# EAGLE schematic floppyemu (EAGLE 6.3)
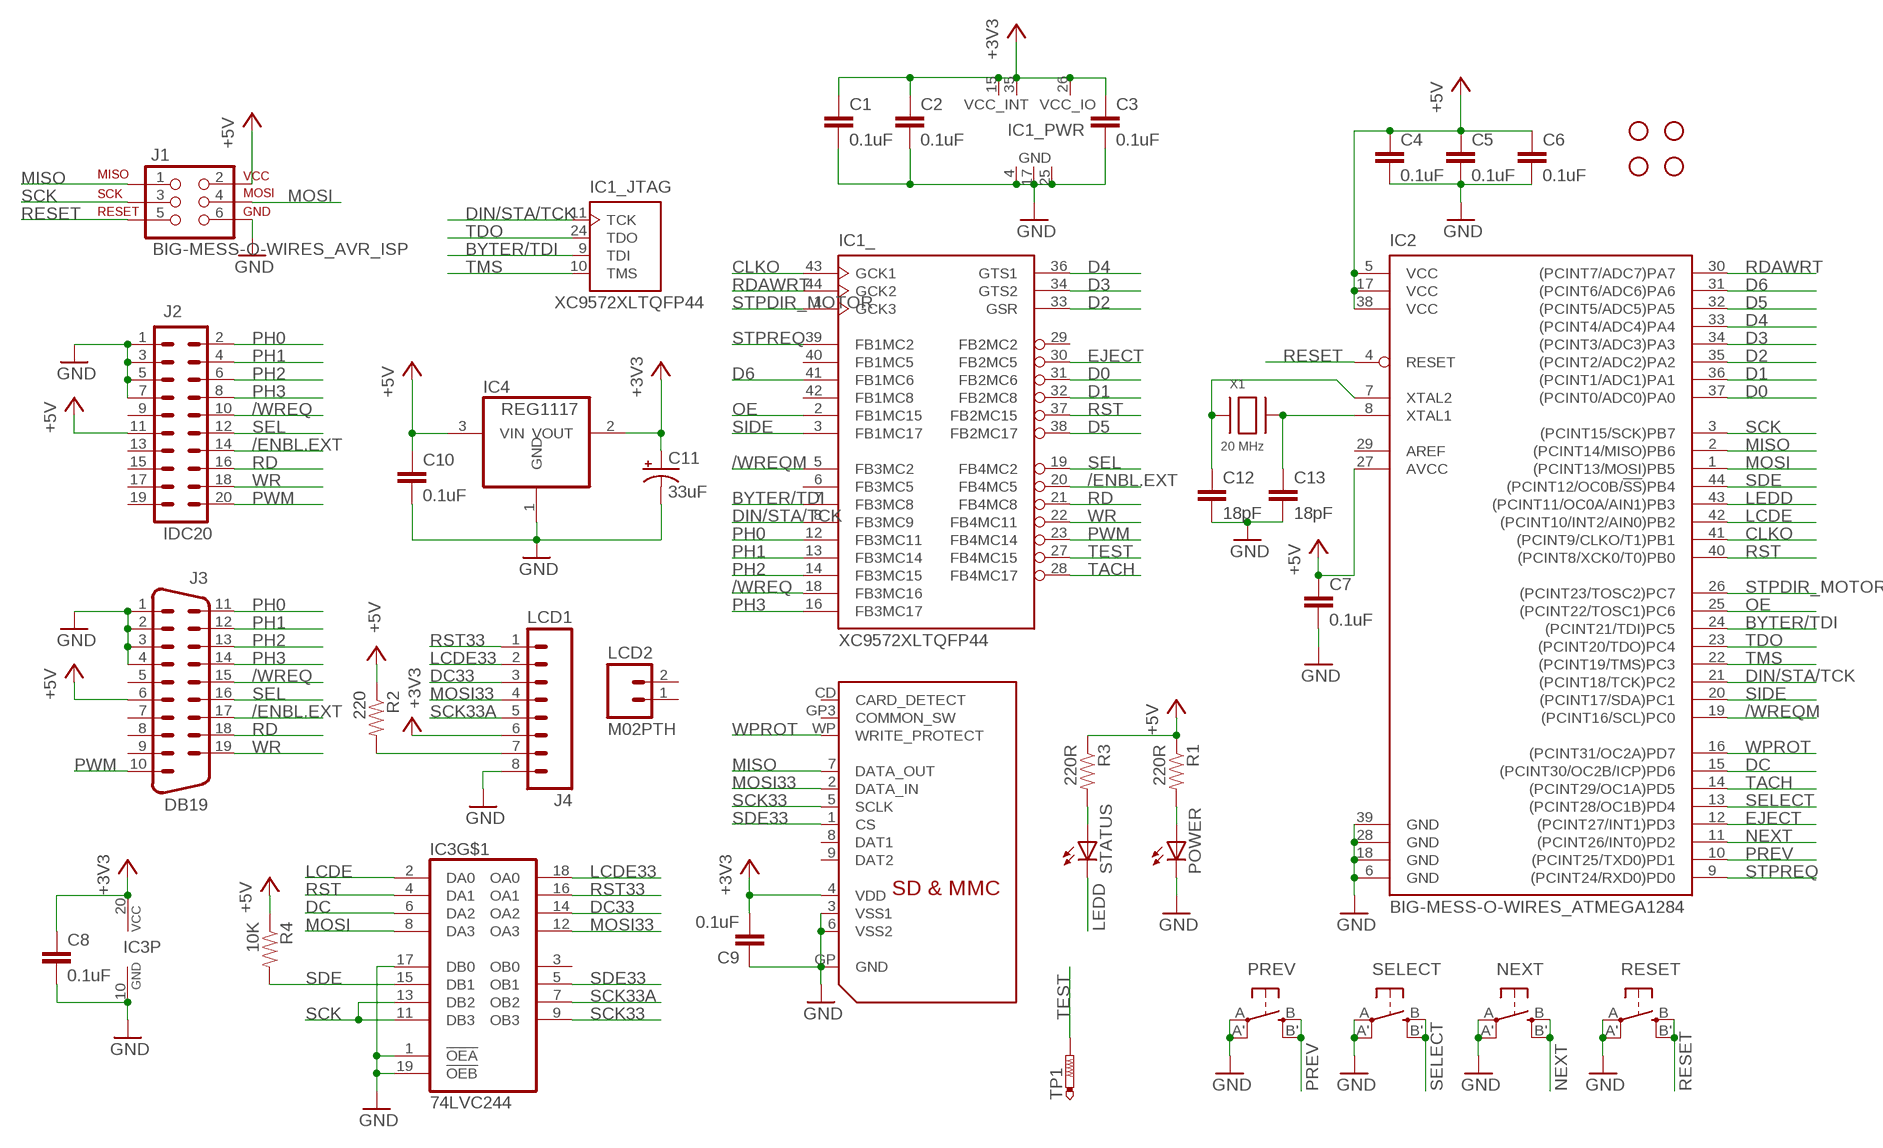
[diagram p0: schematic, sheet 1]

## Parts
C1  0.1uF  CAP0805  [0805]
C2  0.1uF  CAP0805  [0805]
C3  0.1uF  CAP0805  [0805]
C4  0.1uF  CAP0805  [0805]
C5  0.1uF  CAP0805  [0805]
C6  0.1uF  CAP0805  [0805]
C7  0.1uF  CAP0805  [0805]
C8  0.1uF  CAP0805  [0805]
C9  0.1uF  CAP0805  [0805]
C10  0.1uF  CAP0805  [0805]
C11  33uF  47UF-TANT  [EIA3528]
C12  18pF  CAP0805  [0805]
C13  18pF  CAP0805  [0805]
IC1  XC9572XLTQFP44  [TQFP44-LONGPADS]
IC2  BIG-MESS-O-WIRES_ATMEGA1284  [BIG-MESS-O-WIRES_TQFP44-LONGPADS]
IC3  74LVC244  74X244  [SSOP20]
IC4  REG1117  [SOT223]
J1  BIG-MESS-O-WIRES_AVR_ISP  [BIG-MESS-O-WIRES_2X3-SHROUDED]
J2  IDC20  [IDC20]
J3  DB19  DB19EDGE  [DB19EDGE]
J4  LCD1  M081X08  [1X08]
LCD2  M02PTH  [1X02]
NEXT  B3FS-10XX  [B3FS]
POWER  LEDCHIPLED_0805  [CHIPLED_0805]
PREV  B3FS-10XX  [B3FS]
R1  220R  RESISTOR0805-RES  [0805]
R2  220  RESISTORPTH-1/6W  [1/6W-RES]
R3  220R  RESISTOR0805-RES  [0805]
R4  10K  RESISTOR0805-RES  [0805]
RESET  B3FS-10XX  [B3FS]
SELECT  B3FS-10XX  [B3FS]
STANDOFF1  STAND-OFF  [STAND-OFF]
STANDOFF2  STAND-OFF  [STAND-OFF]
STANDOFF3  STAND-OFF  [STAND-OFF]
STANDOFF4  STAND-OFF  [STAND-OFF]
STATUS  LEDCHIPLED_0805  [CHIPLED_0805]
TP1  PTR1PAD1-13  [P1-13]
U1  ADAFRUIT_SDMMC06132  [ADAFRUIT_06132]
X1  20 MHz  XTALNX5032  [NX5032]

## Nets
+3V3: C1.1 C2.1 C3.1 C8.1 C9.2 C11.A(+) IC1.15(_PWR:VCC_INT) IC1.26(_PWR:VCC_IO) IC1.35(_PWR:VCC_INT) IC3.20(P:VCC) IC4.2(VOUT) J4.6 U1.4(VDD)
+5V: C4.1 C5.1 C6.1 C7.1 C10.1 IC2.5(VCC) IC2.17(VCC) IC2.27(AVCC) IC2.38(VCC) IC4.3(VIN) J1.2 J2.11 J3.6 R1.1 R2.1 R3.1 R4.1
/ENBL.EXT: IC1.20(_:FB4MC5) J2.14 J3.17
/WREQ: IC1.18(_:FB3MC16) J2.10 J3.15
/WREQM: IC1.5(_:FB3MC2) IC2.19((PCINT16/SCL)PC0)
BYTER/TDI: IC1.7(_:FB3MC8) IC1.9(_JTAG:TDI) IC2.24((PCINT21/TDI)PC5)
CLKO: IC1.43(_:GCK1) IC2.41((PCINT9/CLKO/T1)PB1)
D0: IC1.31(_:FB2MC6) IC2.37((PCINT0/ADC0)PA0)
D1: IC1.32(_:FB2MC8) IC2.36((PCINT1/ADC1)PA1)
D2: IC1.33(_:GSR) IC2.35((PCINT2/ADC2)PA2)
D3: IC1.34(_:GTS2) IC2.34((PCINT3/ADC3)PA3)
D4: IC1.36(_:GTS1) IC2.33((PCINT4/ADC4)PA4)
D5: IC1.38(_:FB2MC17) IC2.32((PCINT5/ADC5)PA5)
D6: IC1.41(_:FB1MC6) IC2.31((PCINT6/ADC6)PA6)
DC: IC2.15((PCINT30/OC2B/ICP)PD6) IC3.6(DA2)
DC33: IC3.14(OA2) J4.3
DIN/STA/TCK: IC1.8(_:FB3MC9) IC1.11(_JTAG:TCK) IC2.21((PCINT18/TCK)PC2)
EJECT: IC1.30(_:FB2MC5) IC2.12((PCINT27/INT1)PD3)
GND: C1.2 C2.2 C3.2 C4.2 C5.2 C6.2 C7.2 C8.2 C9.1 C10.2 C11.C(-) C12.2 C13.2 IC1.4(_PWR:GND) IC1.17(_PWR:GND) IC1.25(_PWR:GND) IC2.6(GND) IC2.18(GND) IC2.28(GND) IC2.39(GND) IC3.1(!OEA) IC3.10(P:GND) IC3.17(DB0) IC3.19(!OEB) IC4.1(GND) J1.6 J2.1 J2.3 J2.5 J2.7 J3.1 J3.2 J3.3 J3.4 J4.8 NEXT.A NEXT.A' POWER.C PREV.A PREV.A' RESET.A RESET.A' SELECT.A SELECT.A' U1.3(VSS1) U1.6(VSS2) U1.GP(GND)
LCDE: IC2.42((PCINT10/INT2/AIN0)PB2) IC3.2(DA0)
LCDE33: IC3.18(OA0) J4.2
LEDD: IC2.43((PCINT11/OC0A/AIN1)PB3) STATUS.C
MISO: IC2.2((PCINT14/MISO)PB6) J1.1 U1.7(DATA_OUT)
MOSI: IC2.1((PCINT13/MOSI)PB5) IC3.8(DA3) J1.4
MOSI33: IC3.12(OA3) J4.4 U1.2(DATA_IN)
N$1: C13.1 IC2.8(XTAL1) X1.P$2
N$2: POWER.A R1.2
N$3: C12.1 IC2.7(XTAL2) X1.P$1
N$5: R3.2 STATUS.A
N$10: J4.7 R2.2
NEXT: IC2.11((PCINT26/INT0)PD2) NEXT.B NEXT.B'
OE: IC1.2(_:FB1MC15) IC2.25((PCINT22/TOSC1)PC6)
PH0: IC1.12(_:FB3MC11) J2.2 J3.11
PH1: IC1.13(_:FB3MC14) J2.4 J3.12
PH2: IC1.14(_:FB3MC15) J2.6 J3.13
PH3: IC1.16(_:FB3MC17) J2.8 J3.14
PREV: IC2.10((PCINT25/TXD0)PD1) PREV.B PREV.B'
PWM: IC1.23(_:FB4MC14) J2.20 J3.10
RD: IC1.21(_:FB4MC8) J2.16 J3.18
RDAWRT: IC1.44(_:GCK2) IC2.30((PCINT7/ADC7)PA7)
RESET: IC2.4(RESET) J1.5 RESET.B RESET.B'
RST: IC1.37(_:FB2MC15) IC2.40((PCINT8/XCK0/T0)PB0) IC3.4(DA1)
RST33: IC3.16(OA1) J4.1
SCK: IC2.3((PCINT15/SCK)PB7) IC3.11(DB3) IC3.13(DB2) J1.3
SCK33: IC3.9(OB3) U1.5(SCLK)
SCK33A: IC3.7(OB2) J4.5
SDE: IC2.44((PCINT12/OC0B/!SS!)PB4) IC3.15(DB1) R4.2
SDE33: IC3.5(OB1) U1.1(CS)
SEL: IC1.19(_:FB4MC2) J2.12 J3.16
SELECT: IC2.13((PCINT28/OC1B)PD4) SELECT.B SELECT.B'
SIDE: IC1.3(_:FB1MC17) IC2.20((PCINT17/SDA)PC1)
STPDIR_MOTOR: IC1.1(_:GCK3) IC2.26((PCINT23/TOSC2)PC7)
STPREQ: IC1.39(_:FB1MC2) IC2.9((PCINT24/RXD0)PD0)
TACH: IC1.28(_:FB4MC17) IC2.14((PCINT29/OC1A)PD5)
TDO: IC1.24(_JTAG:TDO) IC2.23((PCINT20/TDO)PC4)
TEST: IC1.27(_:FB4MC15) TP1.TP
TMS: IC1.10(_JTAG:TMS) IC2.22((PCINT19/TMS)PC3)
WPROT: IC2.16((PCINT31/OC2A)PD7) U1.WP(WRITE_PROTECT)
WR: IC1.22(_:FB4MC11) J2.18 J3.19
Unconnected: IC1.6(_:FB3MC5) IC1.29(_:FB2MC2) IC1.40(_:FB1MC5) IC1.42(_:FB1MC8) IC2.29(AREF) IC3.3(OB0) J2.9 J2.13 J2.15 J2.17 J2.19 J3.5 J3.7 J3.8 J3.9 LCD2.1 LCD2.2 U1.8(DAT1) U1.9(DAT2) U1.CD(CARD_DETECT) U1.GP3(COMMON_SW)

## Library data of the parts
C1-C10 C12 C13 = SparkFun:CAP: Capacitor Standard 0603 ceramic capacitor, and 0.1" leaded capacitor.
C11 = SparkFun-Capacitors:47UF-TANT: 47uF Tantalum SMT CAP-08310- 10V 10% (EIA-3528); PROD_ID: CAP-08310; VALUE: 47uF
IC1 = big-mess-o-wires:XC9572XL
IC2 = big-mess-o-wires:BIG-MESS-O-WIRES_ATMEGA1284: 8-bit Microcontroller with 128K Bytes In-System Programmable Flash Source: http://www.atmel.com/dyn/resources/prod_documents/doc2593.pdf
IC3 = big-mess-o-wires:74X244: MEMORY
IC4 = burr-brown:REG1117: 800mA and 1A Low Dropout (LDO) Positive Regulator 1.8V, 2.5V, 2.85V, 3.3V, 5V, and Adj; MPN: REG1117; OC_FARNELL: 1097566; OC_NEWARK: 14P6981
J1 = big-mess-o-wires:BIG-MESS-O-WIRES_AVR_ISP: AVR ISP 6 Pin - Locking Pins This is the reduced ISP connector for AVR programming. Common on Arduino. This footprint will take up less PCB space and can be used with a 10-pin to 6-pin adapter such as SKU: BOB-08508
J2 = big-mess-o-wires:IDC20
J3 = big-mess-o-wires:DB19: SUB-D
J4 = SparkFun:M08: Header 8 Standard 8-pin 0.1" header. Use with straight break away headers (SKU : PRT-00116), right angle break away headers (PRT-00553), swiss pins (PRT-00743), machine pins (PRT-00117), and female headers (PRT-00115).
LCD2 = SparkFun-Connectors:M02: Standard 2-pin 0.1" header. Use with - straight break away headers ( PRT-00116) - right angle break away headers (PRT-00553) - swiss pins (PRT-00743) - machine pins (PRT-00117) - female headers (PRT-00115) Molex polarized connector foot print use with: PRT-08233 with associated crimp pins and housings. 2.54_SCREWTERM for use with PRT-10571. 3.5mm Screw Terminal footprints for PRT-08084 5mm Screw Terminal footprints for use with PRT-08433
NEXT PREV RESET SELECT = big-mess-o-wires:B3FS-10XX: Omron B3FS-10XX SMD tactile switch
POWER STATUS = led:LED: LED OSRAM: - CHIPLED LG R971, LG N971, LY N971, LG Q971, LY Q971, LO R971, LY R971 LH N974, LH R974 LS Q976, LO Q976, LY Q976 LO Q996 - Hyper CHIPLED LW Q18S LB Q993, LB Q99A, LB R99A - SideLED LS A670, LO A670, LY A670, LG A670, LP A670 LB A673, LV A673, LT A673, LW A673 LH A674 LY A675 LS A676, LA A676, LO A676, LY A676, LW A676 LS A679, LY A679, LG A679 - Hyper Micro SIDELED® LS Y876, LA Y876, LO Y876, LY Y876 LT Y87S - SmartLED LW L88C, LW L88S LB L89C, LB L89S, LG L890 LS L89K, LO L89K, LY L89K LS L896, LA L896, LO L896, LY L896 - TOPLED LS T670, LO T670, LY T670, LG T670, LP T670 LSG T670, LSP T670, LSY T670, LOP T670, LYG T670 LG T671, LOG T671, LSG T671 LB T673, LV T673, LT T673, LW T673 LH T674 LS T676, LA T676, LO T676, LY T676, LB T676, LH T676, LSB T676, LW T676 LB T67C, LV T67C, LT T67C, LS T67K, LO T67K, LY T67K, LW E67C LS E67B, LA E67B, LO E67B, LY E67B, LB E67C, LV E67C, LT E67C LW T67C LS T679, LY T679, LG T679 LS T770, LO T770, LY T770, LG T770, LP T770 LB T773, LV T773, LT T773, LW T773 LH T774 LS E675, LA E675, LY E675, LS T675 LS T776, LA T776, LO T776, LY T776, LB T776 LHGB T686 LT T68C, LB T68C - Hyper Mini TOPLED® LB M676 - Mini TOPLED Santana® LG M470 LS M47K, LO M47K, LY M47K Source: http://www.osram.convergy.de LUXEON: - LUMILED® LXK2-PW12-R00, LXK2-PW12-S00, LXK2-PW14-U00, LXK2-PW14-V00 LXK2-PM12-R00, LXK2-PM12-S00, LXK2-PM14-U00 LXK2-PE12-Q00, LXK2-PE12-R00, LXK2-PE12-S00, LXK2-PE14-T00, LXK2-PE14-U00 LXK2-PB12-K00, LXK2-PB12-L00, LXK2-PB12-M00, LXK2-PB14-N00, LXK2-PB14-P00, LXK2-PB14-Q00 LXK2-PR12-L00, LXK2-PR12-M00, LXK2-PR14-Q00, LXK2-PR14-R00 LXK2-PD12-Q00, LXK2-PD12-R00, LXK2-PD12-S00 LXK2-PH12-R00, LXK2-PH12-S00 LXK2-PL12-P00, LXK2-PL12-Q00, LXK2-PL12-R00 Source: www.luxeon.com KINGBRIGHT: KA-3528ASYC Source: www.kingbright.com
R1 R3 R4 = SparkFun:RESISTOR: Resistor Basic schematic elements and footprints for 0603, 1206, and PTH resistors.
R2 = SparkFun-Resistors:RESISTOR: Resistor Basic schematic elements and footprints for 0603, 1206, and PTH resistors.
STANDOFF1-STANDOFF4 = SparkFun-Electromechanical:STAND-OFF: #4 Stand Off This is the mechanical footprint for a #4 phillips button head screw. Use the keepout ring to avoid running the screw head into surrounding components. SKU : PRT-00447
TP1 = testpad:PTR1: TEST PIN
U1 = big-mess-o-wires:ADAFRUIT_SDMMC: SD MMC Card holder 4UCON part #06132 - easy to solder
X1 = adafruit:XTAL: Low cost SMT crystals, no capacitors included http://www.ladyada.net/library/eagle